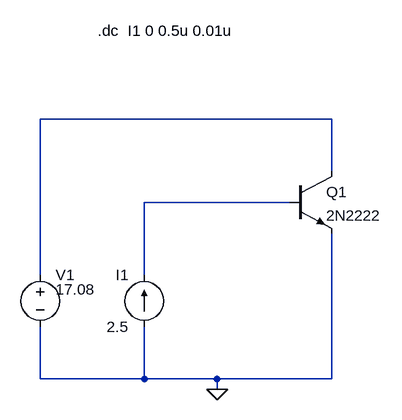
[diagram p0: schematic labo_E3.asc]
labo_E3.asc, the LTspice schematic file:
Version 4
SHEET 1 880 768
WIRE 448 336 0 336
WIRE 448 416 448 336
WIRE 384 464 160 464
WIRE 0 576 0 336
WIRE 160 576 160 464
WIRE 0 736 0 656
WIRE 160 736 160 656
WIRE 160 736 0 736
WIRE 272 736 160 736
WIRE 448 736 448 512
WIRE 448 736 272 736
WIRE 272 752 272 736
FLAG 272 752 0
SYMBOL voltage 0 560 R0
WINDOW 3 24 38 Left 2
SYMATTR Value 17.08
SYMATTR InstName V1
SYMBOL npn 384 416 R0
SYMATTR InstName Q1
SYMATTR Value 2N2222
SYMBOL current 160 656 R180
WINDOW 0 24 80 Left 2
WINDOW 3 24 0 Left 2
SYMATTR InstName I1
SYMATTR Value 2.5
TEXT 88 200 Left 2 !.dc  I1 0 0.5u 0.01u

The netlist it stands for:
* labo_E3.asc
V1 N001 0 17.08
Q1 N001 N002 0 0 2N2222
I1 0 N002 2.5
.model NPN NPN
.model PNP PNP
.lib standard.bjt
.dc  I1 0 0.5u 0.01u
.backanno
.end